# EAGLE schematic wheelDesign_schematic (EAGLE 9.7.0)
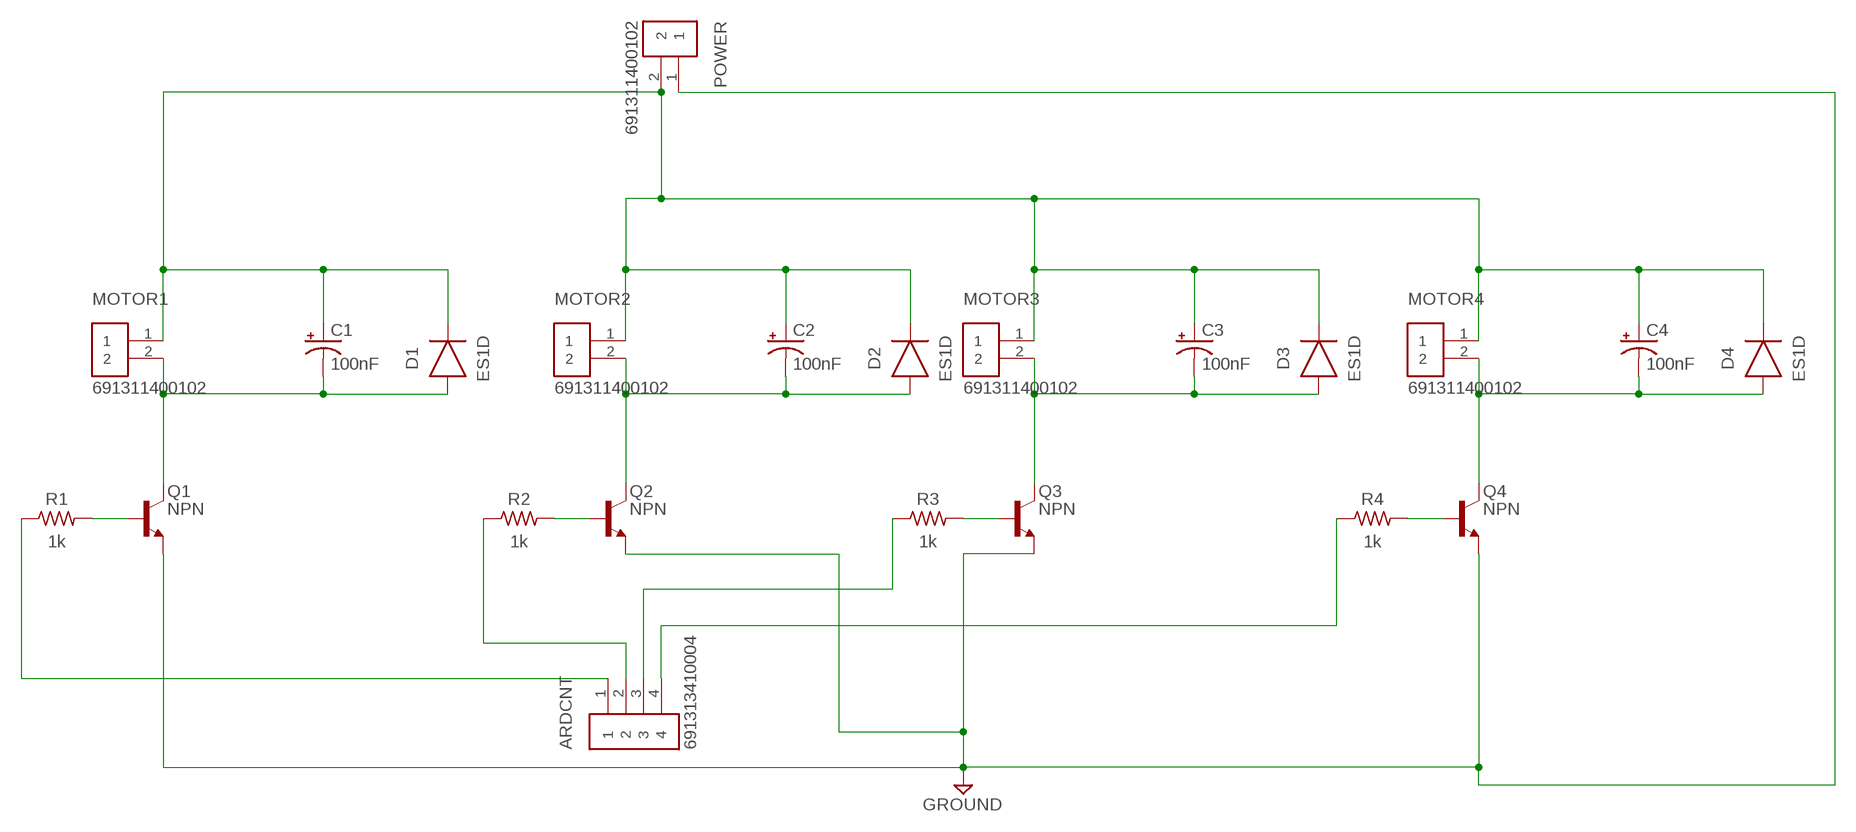
[diagram p0: schematic, sheet 1]

## Parts
ARDCNT  691313410004  [TERMINALBLOCK_PLUGGABLE-4-7.62MM]
C1  100nF  C-POL-US_AXIAL-34.1MM-PITCH  [CAPPAD3410W80L3025D1825B]
C2  100nF  C-POL-US_AXIAL-34.1MM-PITCH  [CAPPAD3410W80L3025D1825B]
C3  100nF  C-POL-US_AXIAL-34.1MM-PITCH  [CAPPAD3410W80L3025D1825B]
C4  100nF  C-POL-US_AXIAL-34.1MM-PITCH  [CAPPAD3410W80L3025D1825B]
D1  ES1D  DIODE_ES1D_SMA  [DIOM5226X290N]
D2  ES1D  DIODE_ES1D_SMA  [DIOM5226X290N]
D3  ES1D  DIODE_ES1D_SMA  [DIOM5226X290N]
D4  ES1D  DIODE_ES1D_SMA  [DIOM5226X290N]
MOTOR1  691311400102  [TERMINALBLOCK_PLUGGABLE-2-7.62MM]
MOTOR2  691311400102  [TERMINALBLOCK_PLUGGABLE-2-7.62MM]
MOTOR3  691311400102  [TERMINALBLOCK_PLUGGABLE-2-7.62MM]
MOTOR4  691311400102  [TERMINALBLOCK_PLUGGABLE-2-7.62MM]
POWER  691311400102  [TERMINALBLOCK_PLUGGABLE-2-7.62MM]
Q1  NPN  NPN_TO18-EBC  [TO18]
Q2  NPN  NPN_TO18-EBC  [TO18]
Q3  NPN  NPN_TO18-EBC  [TO18]
Q4  NPN  NPN_TO18-EBC  [TO18]
R1  1k  R-US_AXIAL-7.2MM-PITCH  [RESAD724W46L381D178B]
R2  1k  R-US_AXIAL-7.2MM-PITCH  [RESAD724W46L381D178B]
R3  1k  R-US_AXIAL-7.2MM-PITCH  [RESAD724W46L381D178B]
R4  1k  R-US_AXIAL-7.2MM-PITCH  [RESAD724W46L381D178B]

## Nets
GROUND: POWER.1 Q1.1(E) Q2.1(E) Q3.1(E) Q4.1(E)
N$1: C1.1(+) C2.1(+) C3.1(+) C4.1(+) D1.1(C) D2.1(C) D3.1(C) D4.1(C) MOTOR1.1 MOTOR2.1 MOTOR3.1 MOTOR4.1 POWER.2
N$2: Q1.2(B) R1.2
N$3: C1.2(-) D1.2(A) MOTOR1.2 Q1.3(C)
N$4: ARDCNT.1 R1.1
N$5: ARDCNT.2 R2.1
N$6: C2.2(-) D2.2(A) MOTOR2.2 Q2.3(C)
N$7: Q2.2(B) R2.2
N$8: ARDCNT.3 R3.1
N$10: C3.2(-) D3.2(A) MOTOR3.2 Q3.3(C)
N$11: Q3.2(B) R3.2
N$12: ARDCNT.4 R4.1
N$14: C4.2(-) D4.2(A) MOTOR4.2 Q4.3(C)
N$15: Q4.2(B) R4.2

## Library data of the parts
ARDCNT = Terminal Blocks:691313410004: 7.62MM CLOSED HORIZONTAL PCB HEADER WR-TBL Manufacturer's datasheet <https://katalog.we-online.com/em/datasheet/6913134100xx.pdf>; CREATED_BY: PCBLayout.com; DIGIKEY_PART_NO: 732-2837-ND; MANUFACTURER: WURTH ELEKTRONIK; MPN: 691313410004
C1-C4 = Capacitor:C-POL-US: Capacitor Polarised - ANSI; CATEGORY: Capacitor
D1-D4 = Diode:DIODE_: Diode Rectifier - Popular parts; CATEGORY: Diode; DESCRIPTION: DIODE GEN PURP 200V 1A SMA; MANUFACTURER: ON Semiconductor; SUB-CATEGORY: Rectifier
MOTOR1-MOTOR4 POWER = Terminal Blocks:691311400102: 7.62MM CLOSE VERTICAL PCB HEADER WR-TBL Manufacturer's datasheet <https://katalog.we-online.com/em/datasheet/6913114001xx.pdf>; CREATED_BY: PCBLayout.com; DIGIKEY_PART_NO: 732-2823-ND; MANUFACTURER: WURTH ELEKTRONIK; MPN: 691311400102
Q1-Q4 = Transistor:NPN: NPN - Generic; CATEGORY: Transistor; SUB-CATEGORY: BJT; TYPE: NPN
R1-R4 = Resistor:R-US: Resistor Fixed - ANSI; CATEGORY: Resistor; SUB-CATEGORY: Fixed